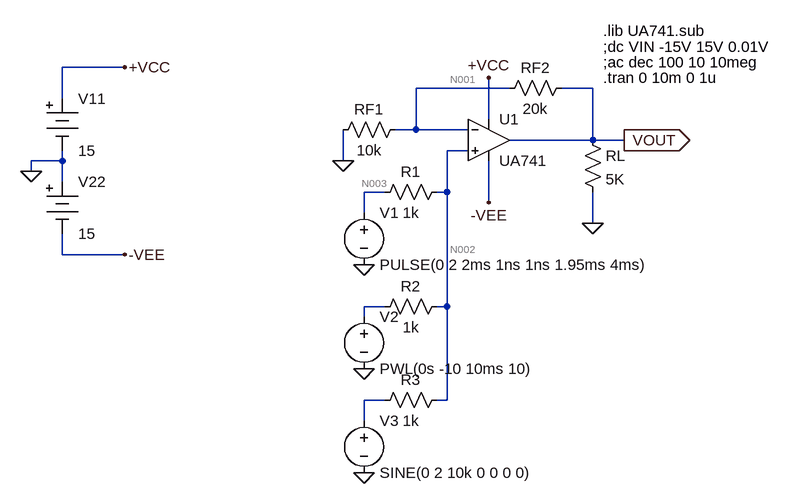
[diagram p0: schematic lab1-3.asc]
lab1-3.asc, the LTspice schematic file:
Version 4
SHEET 1 880 680
WIRE -384 32 -480 32
WIRE 208 64 64 64
WIRE 336 64 288 64
WIRE -480 80 -480 32
WIRE 176 112 176 48
WIRE 64 128 64 64
WIRE 64 128 32 128
WIRE 144 128 64 128
WIRE 336 144 336 64
WIRE 336 144 208 144
WIRE 384 144 336 144
WIRE 144 160 112 160
WIRE -480 176 -480 160
WIRE -480 176 -528 176
WIRE -48 176 -48 128
WIRE -528 192 -528 176
WIRE -480 208 -480 176
WIRE 16 224 -16 224
WIRE 112 224 112 160
WIRE 112 224 96 224
WIRE 176 240 176 176
WIRE -16 256 -16 224
WIRE 336 272 336 224
WIRE -480 320 -480 288
WIRE -384 320 -480 320
WIRE 16 400 -16 400
WIRE 112 400 112 224
WIRE 112 400 96 400
WIRE -16 416 -16 400
WIRE 16 544 -16 544
WIRE 112 544 112 400
WIRE 112 544 96 544
WIRE -16 576 -16 544
FLAG -528 192 0
FLAG 336 272 0
FLAG -384 32 +VCC
FLAG 176 48 +VCC
FLAG -384 320 -VEE
FLAG 176 240 -VEE
FLAG 384 144 VOUT
IOPIN 384 144 Out
FLAG -48 176 0
FLAG -16 336 0
FLAG -16 496 0
FLAG -16 656 0
SYMBOL Opamps\\opamp2 176 80 R0
SYMATTR InstName U1
SYMATTR Value UA741
SYMBOL res 320 128 R0
SYMATTR InstName RL
SYMATTR Value 5K
SYMBOL Misc\\battery -480 64 R0
WINDOW 123 0 0 Left 2
WINDOW 39 0 0 Left 2
SYMATTR InstName V11
SYMATTR Value 15
SYMBOL Misc\\battery -480 192 R0
WINDOW 123 0 0 Left 2
WINDOW 39 0 0 Left 2
SYMATTR InstName V22
SYMATTR Value 15
SYMBOL res 48 112 R90
WINDOW 0 0 56 VBottom 2
WINDOW 3 32 56 VTop 2
SYMATTR InstName RF1
SYMATTR Value 10k
SYMBOL res 304 48 R90
WINDOW 0 0 56 VBottom 2
WINDOW 3 32 56 VTop 2
SYMATTR InstName RF2
SYMATTR Value 20k
SYMBOL voltage -16 240 R0
WINDOW 123 0 0 Left 2
WINDOW 39 0 0 Left 2
SYMATTR InstName V1
SYMATTR Value PULSE(0 2 2ms 1ns 1ns 1.95ms 4ms)
SYMBOL voltage -16 400 R0
WINDOW 123 0 0 Left 2
WINDOW 39 0 0 Left 2
SYMATTR InstName V2
SYMATTR Value PWL(0s -10 10ms 10)
SYMBOL voltage -16 560 R0
WINDOW 123 0 0 Left 2
WINDOW 39 0 0 Left 2
SYMATTR InstName V3
SYMATTR Value SINE(0 2 10k 0 0 0 0)
SYMBOL res 112 208 R90
WINDOW 0 0 56 VBottom 2
WINDOW 3 32 56 VTop 2
SYMATTR InstName R1
SYMATTR Value 1k
SYMBOL res 112 384 R90
WINDOW 0 0 56 VBottom 2
WINDOW 3 32 56 VTop 2
SYMATTR InstName R2
SYMATTR Value 1k
SYMBOL res 112 528 R90
WINDOW 0 0 56 VBottom 2
WINDOW 3 32 56 VTop 2
SYMATTR InstName R3
SYMATTR Value 1k
TEXT 352 -24 Left 2 !.lib UA741.sub
TEXT 352 0 Left 2 !;dc VIN -15V 15V 0.01V
TEXT 352 24 Left 2 !;ac dec 100 10 10meg
TEXT 352 48 Left 2 !.tran 0 10m 0 1u

The netlist it stands for:
* lab1-3.asc
XU1 N002 N001 +VCC -VEE VOUT UA741  ; pins In+ In- V+ V- OUT
RL VOUT 0 5K
V11 +VCC 0 15
V22 0 -VEE 15
RF1 N001 0 10k
RF2 VOUT N001 20k
V1 N003 0 PULSE(0 2 2ms 1ns 1ns 1.95ms 4ms)
V2 N004 0 PWL(0s -10 10ms 10)
V3 N005 0 SINE(0 2 10k 0 0 0 0)
R1 N002 N003 1k
R2 N002 N004 1k
R3 N002 N005 1k
.lib UA741.sub
;dc VIN -15V 15V 0.01V
;ac dec 100 10 10meg
.tran 0 10m 0 1u
.backanno
.end

* Results of the author's LTspice run, read from the files saved beside the schematic
* Operating Point, zero values left out:
*   V(vout) = 1.549 mV
*   V(-vee) = -15 V
*   V(+vcc) = 15 V
*   V(n001) = -15.4 µV
*   V(n002) = -26.58 µV
*   I(R3) = -26.58 nA
*   I(R2) = -26.58 nA
*   I(R1) = -26.58 nA
*   I(Rf2) = 78.22 nA
*   I(Rf1) = -1.54 nA
*   I(Rl) = 309.8 nA
*   I(V3) = -26.58 nA
*   I(V2) = -26.58 nA
*   I(V1) = -26.58 nA
*   I(V22) = -1.667 mA
*   I(V11) = -1.667 mA
*   Ix(u1:1) = 79.74 nA
*   Ix(u1:2) = 79.76 nA
*   Ix(u1:3) = 1.667 mA
*   Ix(u1:4) = -1.667 mA
*   Ix(u1:5) = -388 nA
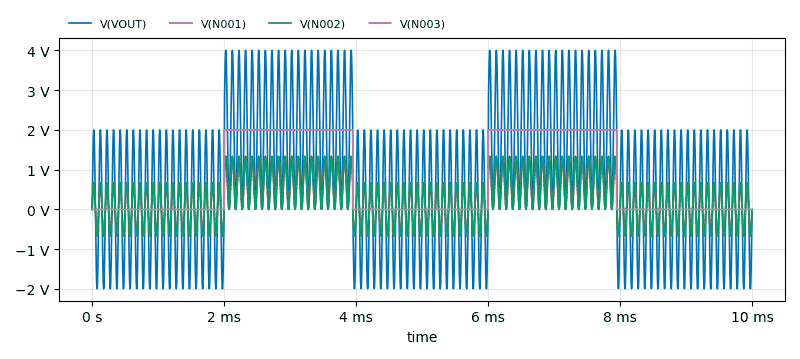
[diagram p1: Transient Analysis of lab1-3.asc, plotted from the saved traces]
* Transient Analysis, 1 run:
*   V(VOUT): min -1.996 V, max 3.999 V, average 781.6 mV, rms 1.899 V, last -56.32 mV
*   V(N001): min -665.8 mV, max 1.332 V, average 260 mV, rms 632.9 mV, last -19.18 mV
*   V(N002): min -665.7 mV, max 1.333 V, average 260 mV, rms 633.1 mV, last -32.91 µV
*   V(N003): min 0 V, max 2 V, average 780 mV, rms 1.249 V, last 0 V